# EAGLE design motor_driver (EAGLE 7.1.0)
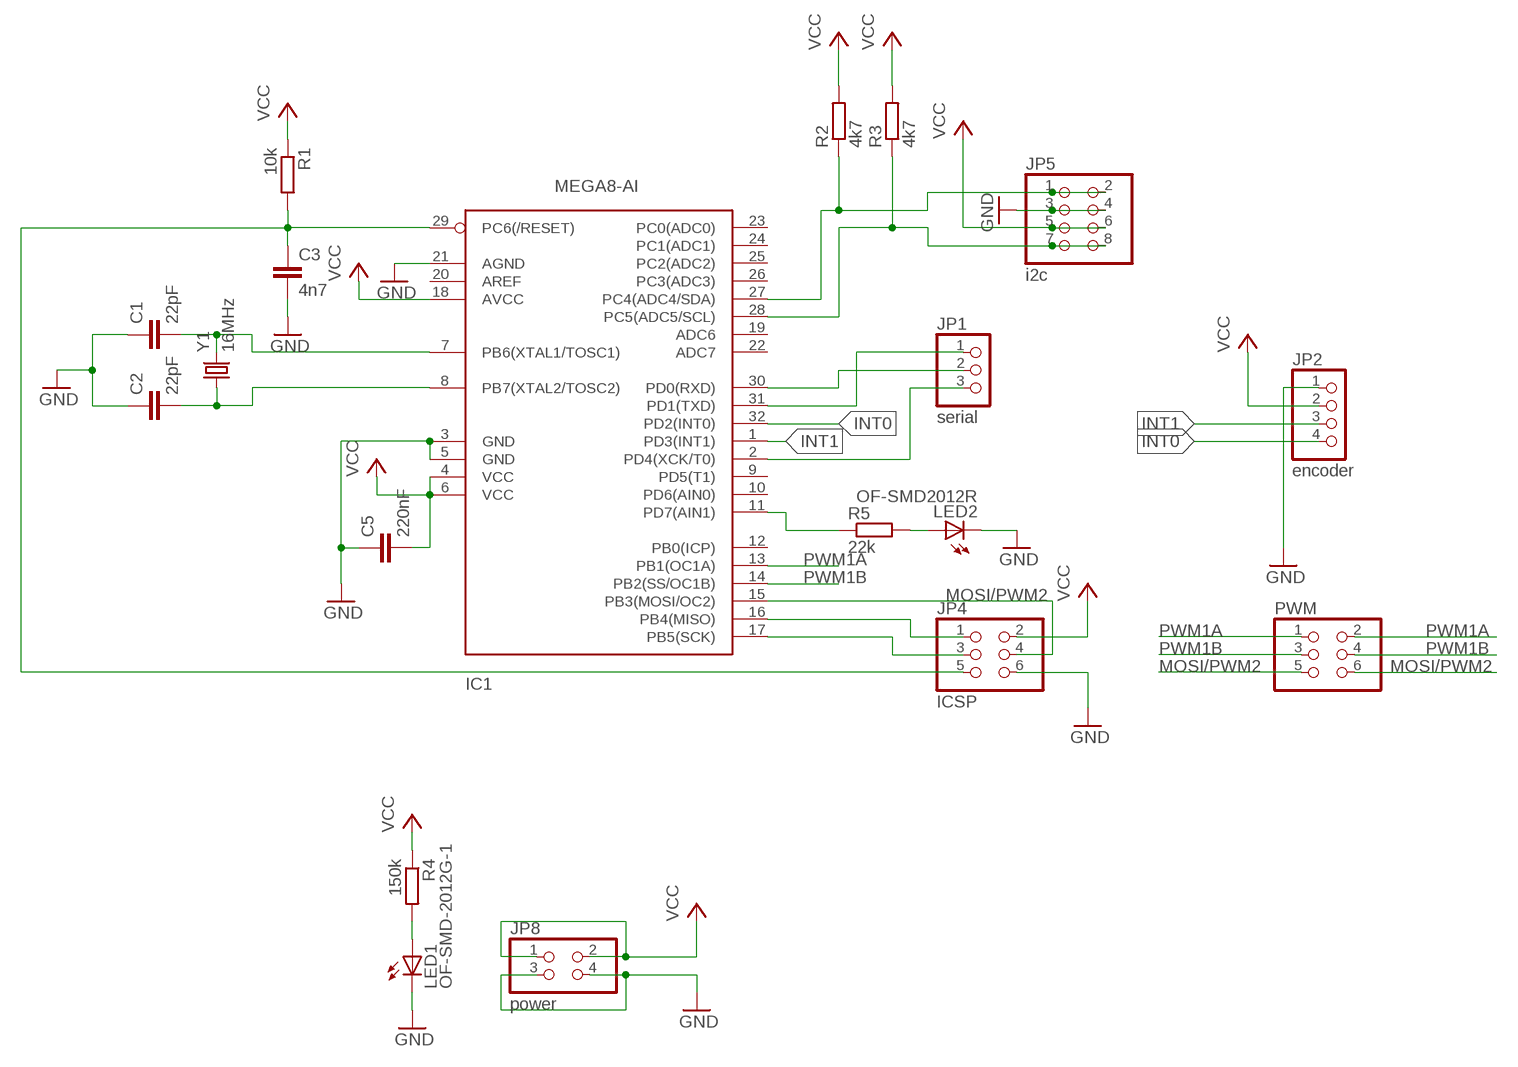
[diagram p0: schematic, sheet 1]

## Parts
C1  22pF  CAP1206  [1206]
C2  22pF  CAP1206  [1206]
C3  4n7  CAP1206  [1206]
C5  220nF  CAP0805  [0805]
IC1  MEGA8-AI  [TQFP32-08]
JP1  serial  PINHD-1X03_2.54-S  [1X03-S]
JP2  encoder  PINHD-1X04_2.54-S  [1X04-S]
JP4  ICSP  PINHD-2X03_2.54  [2X03]
JP5  i2c  PINHD-2X04_2.54  [2X04]
JP8  power  PINHD-2X02_2.54  [2X02]
LED1  OF-SMD-2012G-1  LED3MM  [LED3MM]
LED2  OF-SMD2012R  LED3MM  [LED3MM]
PWM  PINHD-2X3  [2X03]
R1  10k  RR1206  [R1206]
R2  4k7  RR1206  [R1206]
R3  4k7  RR1206  [R1206]
R4  150k  R  [R0805]
R5  22k  R  [R0805]
Y1  16MHz  CRYSTALSMD  [HC49UP]

## Nets
GND: C1.1 C2.1 C3.2 C5.1 IC1.3(GND) IC1.5(GND) IC1.21(AGND) JP2.1 JP4.6 JP5.3 JP5.4 JP8.3 JP8.4 LED1.K(C) LED2.K(C)
INT0: IC1.32(PD2(INT0)) JP2.4
INT1: IC1.1(PD3(INT1)) JP2.3
MOSI/PWM2: IC1.15(PB3(MOSI/OC2)) JP4.4 PWM.5 PWM.6
N$1: IC1.31(PD1(TXD)) JP1.1
N$2: C2.2 IC1.8(PB7(XTAL2/TOSC2)) Y1.1
N$3: C1.2 IC1.7(PB6(XTAL1/TOSC1)) Y1.2
N$4: IC1.11(PD7(AIN1)) R5.1
N$5: IC1.30(PD0(RXD)) JP1.2
N$6: IC1.2(PD4(XCK/T0)) JP1.3
N$9: IC1.28(PC5(ADC5/SCL)) JP5.7 JP5.8 R3.1
N$10: IC1.27(PC4(ADC4/SDA)) JP5.1 JP5.2 R2.1
N$11: LED1.A R4.2
N$12: IC1.17(PB5(SCK)) JP4.3
N$13: IC1.16(PB4(MISO)) JP4.1
N$14: LED2.A R5.2
PWM1A: IC1.13(PB1(OC1A)) PWM.1 PWM.2
PWM1B: IC1.14(PB2(SS/OC1B)) PWM.3 PWM.4
RESET: C3.1 IC1.29(PC6(/RESET)) JP4.5 R1.2
VCC: C5.2 IC1.4(VCC) IC1.6(VCC) IC1.18(AVCC) JP2.2 JP4.2 JP5.5 JP5.6 JP8.1 JP8.2 R1.1 R2.2 R3.2 R4.1
Unconnected: IC1.9(PD5(T1)) IC1.10(PD6(AIN0)) IC1.12(PB0(ICP)) IC1.19(ADC6) IC1.20(AREF) IC1.22(ADC7) IC1.23(PC0(ADC0)) IC1.24(PC1(ADC1)) IC1.25(PC2(ADC2)) IC1.26(PC3(ADC3))

## Library data of the parts
C1-C3 C5 = SparkFun-Capacitors:CAP: Capacitor Standard 0603 ceramic capacitor, and 0.1" leaded capacitor.
IC1 = avr-7:MEGA8: MICROCONTROLLER 8 Kbytes FLASH 1 kbytes SRAM 512 bytes EEPROM USART 6-channel 10 bit ADC 2-channel 8 bit ADC
JP1 = pinhead-2:PINHD-1X03: PIN HEADER
JP2 = pinhead-2:PINHD-1X04: PIN HEADER
JP4 = pinhead-2:PINHD-2X03: PIN HEADER
JP5 = pinhead-2:PINHD-2X04: PIN HEADER
JP8 = pinhead-2:PINHD-2X02: PIN HEADER
LED1 LED2 = adafruit:LED: LED OSRAM: - CHIPLED LG R971, LG N971, LY N971, LG Q971, LY Q971, LO R971, LY R971 LH N974, LH R974 LS Q976, LO Q976, LY Q976 LO Q996 - Hyper CHIPLED LW Q18S LB Q993, LB Q99A, LB R99A - SideLED LS A670, LO A670, LY A670, LG A670, LP A670 LB A673, LV A673, LT A673, LW A673 LH A674 LY A675 LS A676, LA A676, LO A676, LY A676, LW A676 LS A679, LY A679, LG A679 - Hyper Micro SIDELED® LS Y876, LA Y876, LO Y876, LY Y876 LT Y87S - SmartLED LW L88C, LW L88S LB L89C, LB L89S, LG L890 LS L89K, LO L89K, LY L89K LS L896, LA L896, LO L896, LY L896 - TOPLED LS T670, LO T670, LY T670, LG T670, LP T670 LSG T670, LSP T670, LSY T670, LOP T670, LYG T670 LG T671, LOG T671, LSG T671 LB T673, LV T673, LT T673, LW T673 LH T674 LS T676, LA T676, LO T676, LY T676, LB T676, LH T676, LSB T676, LW T676 LB T67C, LV T67C, LT T67C, LS T67K, LO T67K, LY T67K, LW E67C LS E67B, LA E67B, LO E67B, LY E67B, LB E67C, LV E67C, LT E67C LW T67C LS T679, LY T679, LG T679 LS T770, LO T770, LY T770, LG T770, LP T770 LB T773, LV T773, LT T773, LW T773 LH T774 LS E675, LA E675, LY E675, LS T675 LS T776, LA T776, LO T776, LY T776, LB T776 LHGB T686 LT T68C, LB T68C - Hyper Mini TOPLED® LB M676 - Mini TOPLED Santana® LG M470 LS M47K, LO M47K, LY M47K Source: http://www.osram.convergy.de/
PWM = pinhead:PINHD-2X3: PIN HEADER
R1-R5 = eagle-ltspice:R: RESISTOR, European symbol; SPICEMODEL: NONE; SPICEPREFIX: R
Y1 = SparkFun-FreqCtrl:CRYSTAL: Various standard crystals. Proven footprints.

## Board
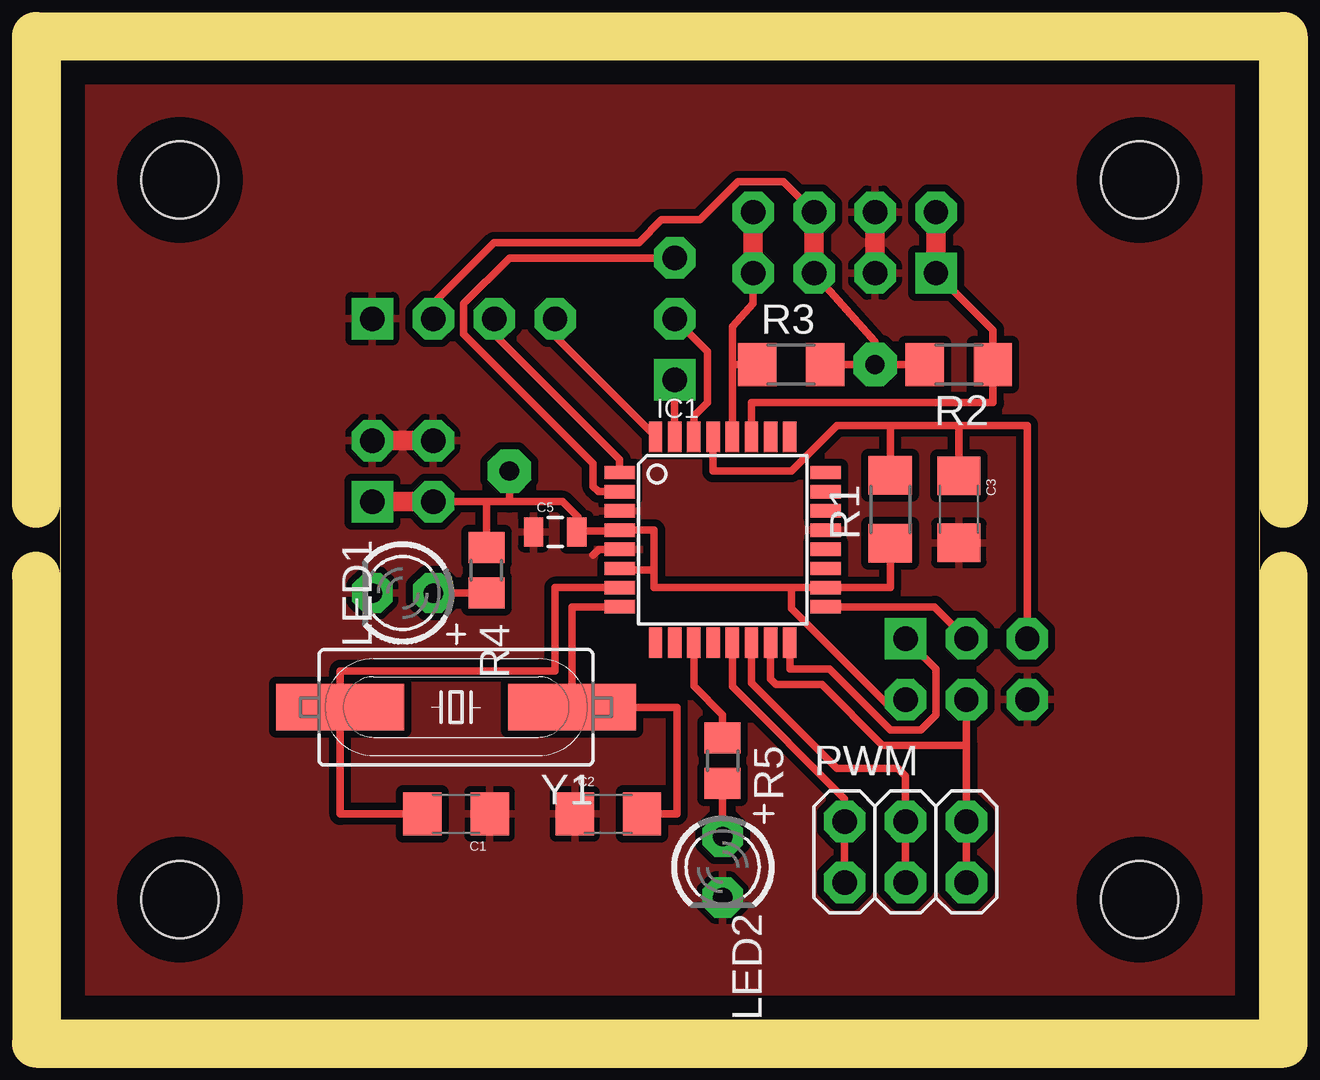
[diagram p1: board, top side]
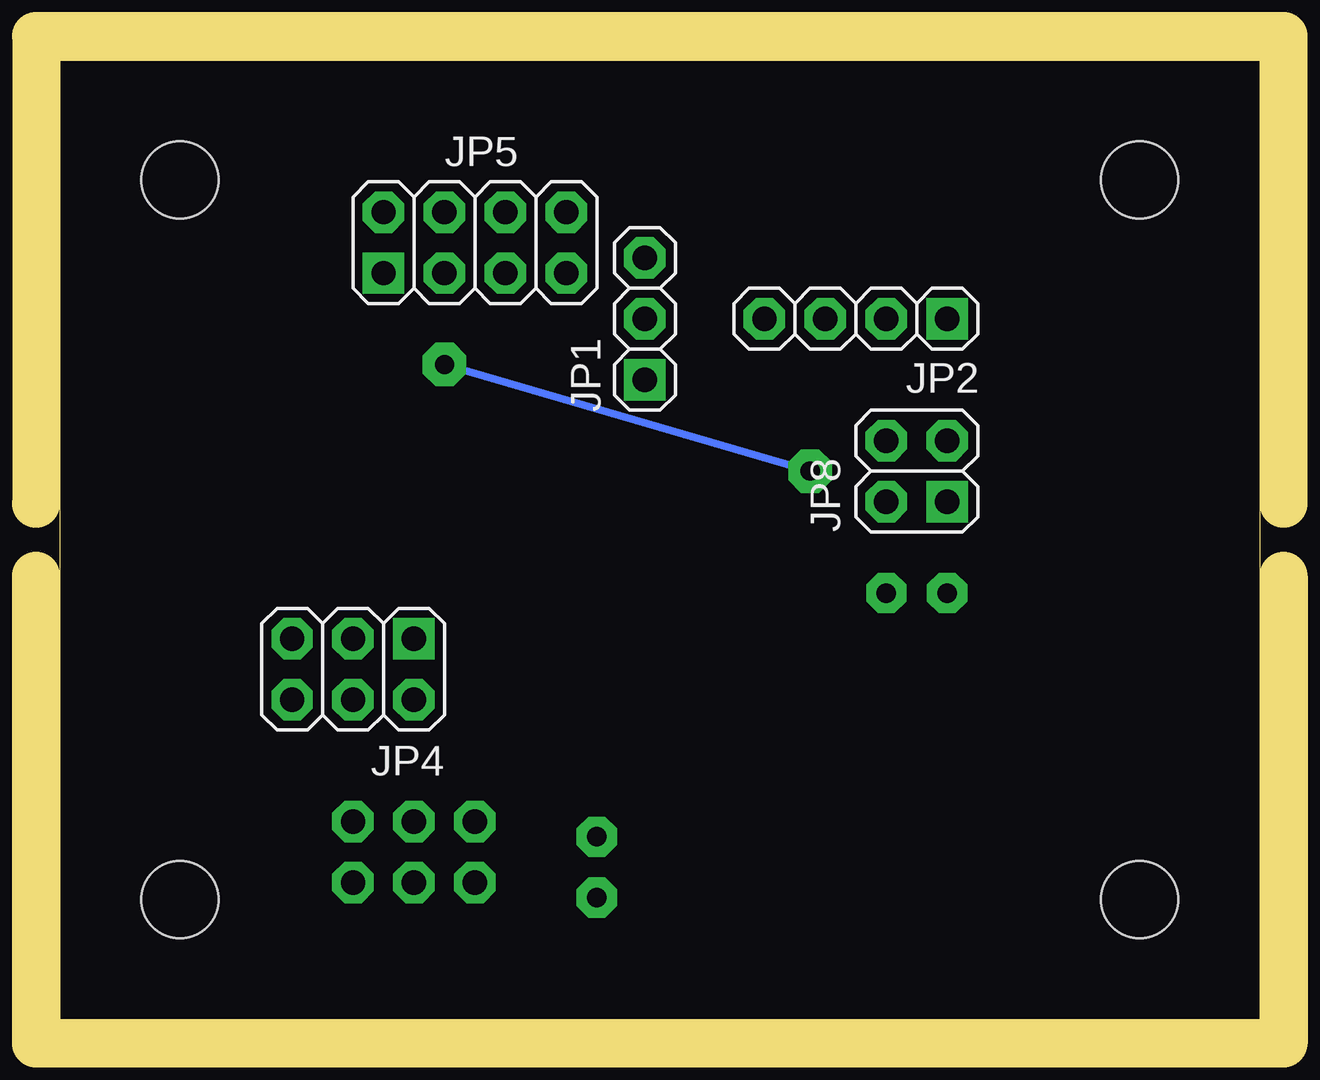
[diagram p2: board, bottom side, seen from below]

Size 50 x 40 mm. Coordinates in mm from the lower left corner, seen from the top.
Outline: 0,0 50,0 50,40 0,40 0,0
Copper layers (1*16): Top 0.035mm / dielectric 1.5mm / Bottom 0.035mm
Design rules "default *": minimum track width 10mil, minimum drill 24mil, track to track 12mil, track to pad 8mil, pad to pad 8mil, via to via 8mil, smd to smd 8mil, copper to edge 40mil, drill to drill 8mil, minimum pad ring 10mil, minimum via ring 8mil, stop-mask expansion 4mil, vias tented up to drill 0mil, thermal gap 10mil
Holes 3.2 mm at 5,35 5,5 45,5 45,35
Milling: 6 lines

### Footprints (pad centres in the part's own frame; a part is rotated, then mirrored left to right if it is on the bottom)
1206 = smd 1.6 x 1.8: 1 -1.4,0; 2 1.4,0
0805 = smd 0.8 x 1.2: 1 -0.9,0; 2 0.9,0
TQFP32-08 = smd 1.27 x 0.559: 1 -4.293,2.8; 2 -4.293,2; 3 -4.293,1.2; 4 -4.293,0.4; 5 -4.293,-0.4; 6 -4.293,-1.2; 7 -4.293,-2; 8 -4.293,-2.8; 17 4.293,-2.8; 18 4.293,-2; 19 4.293,-1.2; 20 4.293,-0.4; 21 4.293,0.4; 22 4.293,1.2; 23 4.293,2; 24 4.293,2.8 | smd 0.559 x 1.27: 9 -2.8,-4.293; 10 -2,-4.293; 11 -1.2,-4.293; 12 -0.4,-4.293; 13 0.4,-4.293; 14 1.2,-4.293; 15 2,-4.293; 16 2.8,-4.293; 25 2.8,4.293; 26 2,4.293; 27 1.2,4.293; 28 0.4,4.293; 29 -0.4,4.293; 30 -1.2,4.293; 31 -2,4.293; 32 -2.8,4.293
1X03-S = drill 1.016 square: 1 -2.54,0 | drill 1.016 octagon: 2 0,0; 3 2.54,0
1X04-S = drill 1.016 square: 1 -3.81,0 | drill 1.016 octagon: 2 -1.27,0; 3 1.27,0; 4 3.81,0
2X03 = drill 1.016 square: 1 -2.54,-1.27 | drill 1.016 octagon: 2 -2.54,1.27; 3 0,-1.27; 4 0,1.27; 5 2.54,-1.27; 6 2.54,1.27
2X04 = drill 1.016 square: 1 -3.81,-1.27 | drill 1.016 octagon: 2 -3.81,1.27; 3 -1.27,-1.27; 4 -1.27,1.27; 5 1.27,-1.27; 6 1.27,1.27; 7 3.81,-1.27; 8 3.81,1.27
2X02 = drill 1.016 square: 1 -1.27,-1.27 | drill 1.016 octagon: 2 -1.27,1.27; 3 1.27,-1.27; 4 1.27,1.27
LED3MM = drill 0.813 pad 1.676 octagon: A -1.27,0; K 1.27,0
2X03' = drill 1.016 octagon: 1 -2.54,-1.27; 2 -2.54,1.27; 3 0,-1.27; 4 0,1.27; 5 2.54,-1.27; 6 2.54,1.27
R1206 = smd 1.6 x 1.803: 1 -1.422,0; 2 1.422,0
R0805 = smd 1.3 x 1.5: 1 -0.95,0; 2 0.95,0
HC49UP = smd 5.334 x 1.93: 1 -4.826,0; 2 4.826,0

### Placement (x,y rotation side)
C1  16.51,8.57 180 top
C2  22.86,8.57 0 top
C3  37.47,21.27 270 top
C5  20.64,20.32 0 top
IC1  27.62,20 0 top
JP1  25.62,29.21 90 bottom
JP2  16.83,29.21 180 bottom
JP4  37.78,14.61 180 bottom
JP5  32.7,32.38 0 bottom
JP8  14.29,22.86 90 bottom
LED1  14.29,17.78 180 top
LED2  27.62,6.35 270 top
PWM  [2X03']  35.24,6.99 0 top
R1  34.61,21.27 90 top
R2  37.47,27.3 180 top
R3  30.48,27.3 0 top
R4  17.78,18.73 270 top
R5  27.62,10.79 270 top
Y1  16.51,13.02 180 top

### Tracks (layer width: path | path; a pad name or v marks a point on that pad's centre or on a via)
GND
  Top 0.305: IC1.5 22.46,19.6 22.23,19.37
  Top 0.813: JP5.4 JP5.3 | JP8.4 JP8.3
  pour Top: -3.49,-2.86 -3.81,41.91 54.61,41.91 54.61,-3.17
INT0
  Top 0.305: IC1.32 20.64,28.48 JP2.4
INT1
  Top 0.305: IC1.1 23.33,23.34 18.1,28.57 JP2.3
MOSI/PWM2
  Top 0.305: 37.78,11.43 34.29,11.43 31.75,13.97 29.84,13.97 29.62,14.19 IC1.15 | PWM.5 PWM.6 37.78,11.43 | 37.78,11.43 JP4.4
N$1
  Top 0.305: IC1.31 JP1.1
N$2
  Top 0.305: IC1.8 21.34,17.2 Y1.1 25.72,13.02 25.72,8.57 C2.2
N$3
  Top 0.305: IC1.7 20.64,18 20.64,14.54 11.68,14.54 Y1.2 11.68,8.57 C1.2
N$4
  Top 0.305: IC1.11 26.42,13.9 27.62,12.7 R5.1
N$5
  Top 0.305: IC1.30 26.42,25.15 26.99,25.72 26.99,27.84 JP1.2
N$6
  Top 0.305: IC1.2 22.45,22 22.23,22.23 22.23,23.18 16.83,28.57 16.83,29.84 18.73,31.75 JP1.3
N$9
  Top 0.305: IC1.28 28.02,27.3 | 28.02,27.3 28.02,28.89 28.89,29.84 JP5.7 | R3.1 28.02,27.3
  Top 0.813: JP5.8 JP5.7
N$10
  Top 0.305: IC1.27 28.82,25.72 38.89,25.72 R2.1 38.89,28.74 JP5.1
  Top 0.813: JP5.2 JP5.1
N$11
  Top 0.305: LED1.A R4.2
N$12
  Top 0.305: IC1.17 36.45,17.2 JP4.3
N$13
  Top 0.305: IC1.16 30.42,14.61 32.07,14.61 34.61,12.06 35.88,12.06 36.51,12.7 36.51,14.61 JP4.1
N$14
  Top 0.305: R5.2 LED2.A
PWM1A
  Top 0.305: IC1.13 28.02,13.89 32.7,9.21 PWM.2 PWM.1
PWM1B
  Top 0.305: IC1.14 28.82,14.04 32.38,10.48 34.92,10.48 35.24,10.16 PWM.4 PWM.3
RESET
  Top 0.305: IC1.29 27.22,22.86 30.48,22.86 32.38,24.77 34.61,24.77 | 34.61,24.77 37.47,24.77 | R1.2 34.61,24.77 | C3.1 37.47,24.77 | 37.47,24.77 40.32,24.77 JP4.5
VCC  (via drill 0.8)
  Top 0.305: 30.48,18 IC1.18 34.61,18 R1.1 | 30.48,18 24.77,18 24.77,18.73 | 24.77,18.73 23.4,18.73 IC1.6 | 24.77,18.73 24.77,20.4 IC1.4 23.3,20.37 21.59,20.37 | 21.59,20.37 C5.2 | R3.2 v33.97,27.3 | v33.97,27.3 R2.2 | JP5.5 33.97,28.26 v33.97,27.3 | v18.73,22.86 18.73,21.59 | 18.73,21.59 17.78,21.59 | 17.78,21.59 JP8.2 | R4.1 17.78,21.59 | 21.59,20.37 21.59,20.95 20.95,21.59 18.73,21.59 | JP5.6 30.16,34.92 28.26,34.92 26.67,33.34 25.08,33.34 24.13,32.38 18.1,32.38 15.56,29.84 JP2.2 | 30.48,18 30.48,17.14 34.61,13.02 JP4.2
  Top 0.813: JP5.6 JP5.5 | JP8.2 JP8.1
  Bottom 0.305: v33.97,27.3 v18.73,22.86